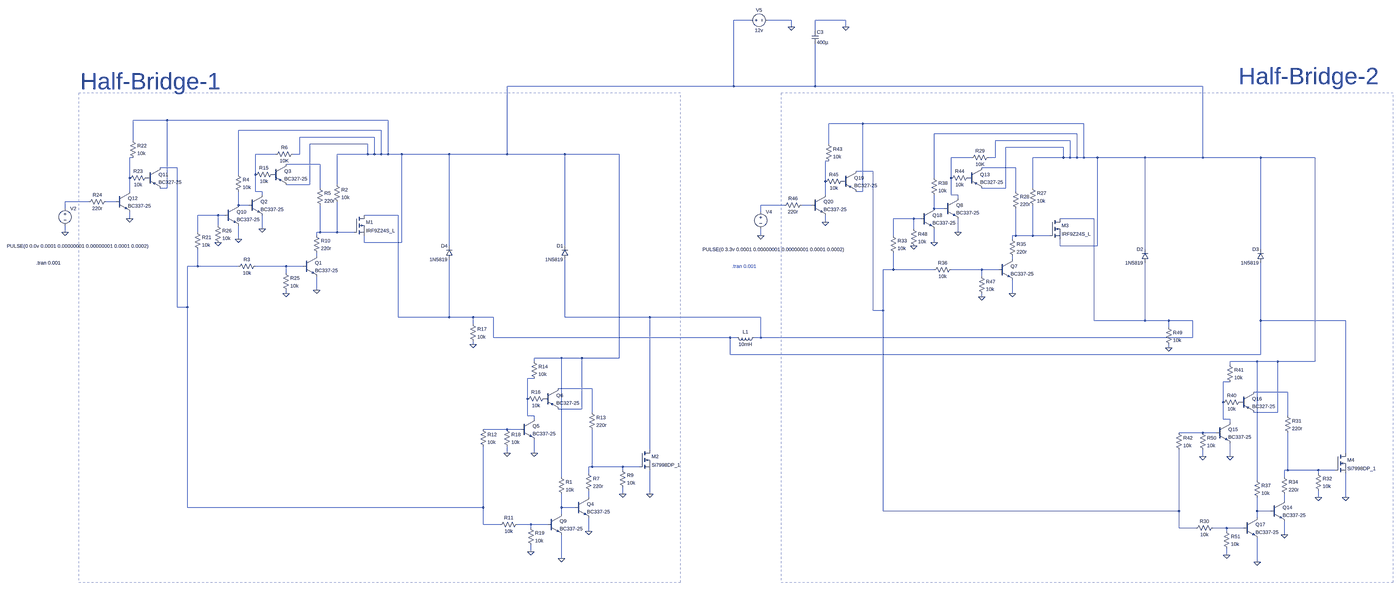
[diagram p0: schematic h-bridge-motor-driver-v1.asc, whole sheet]
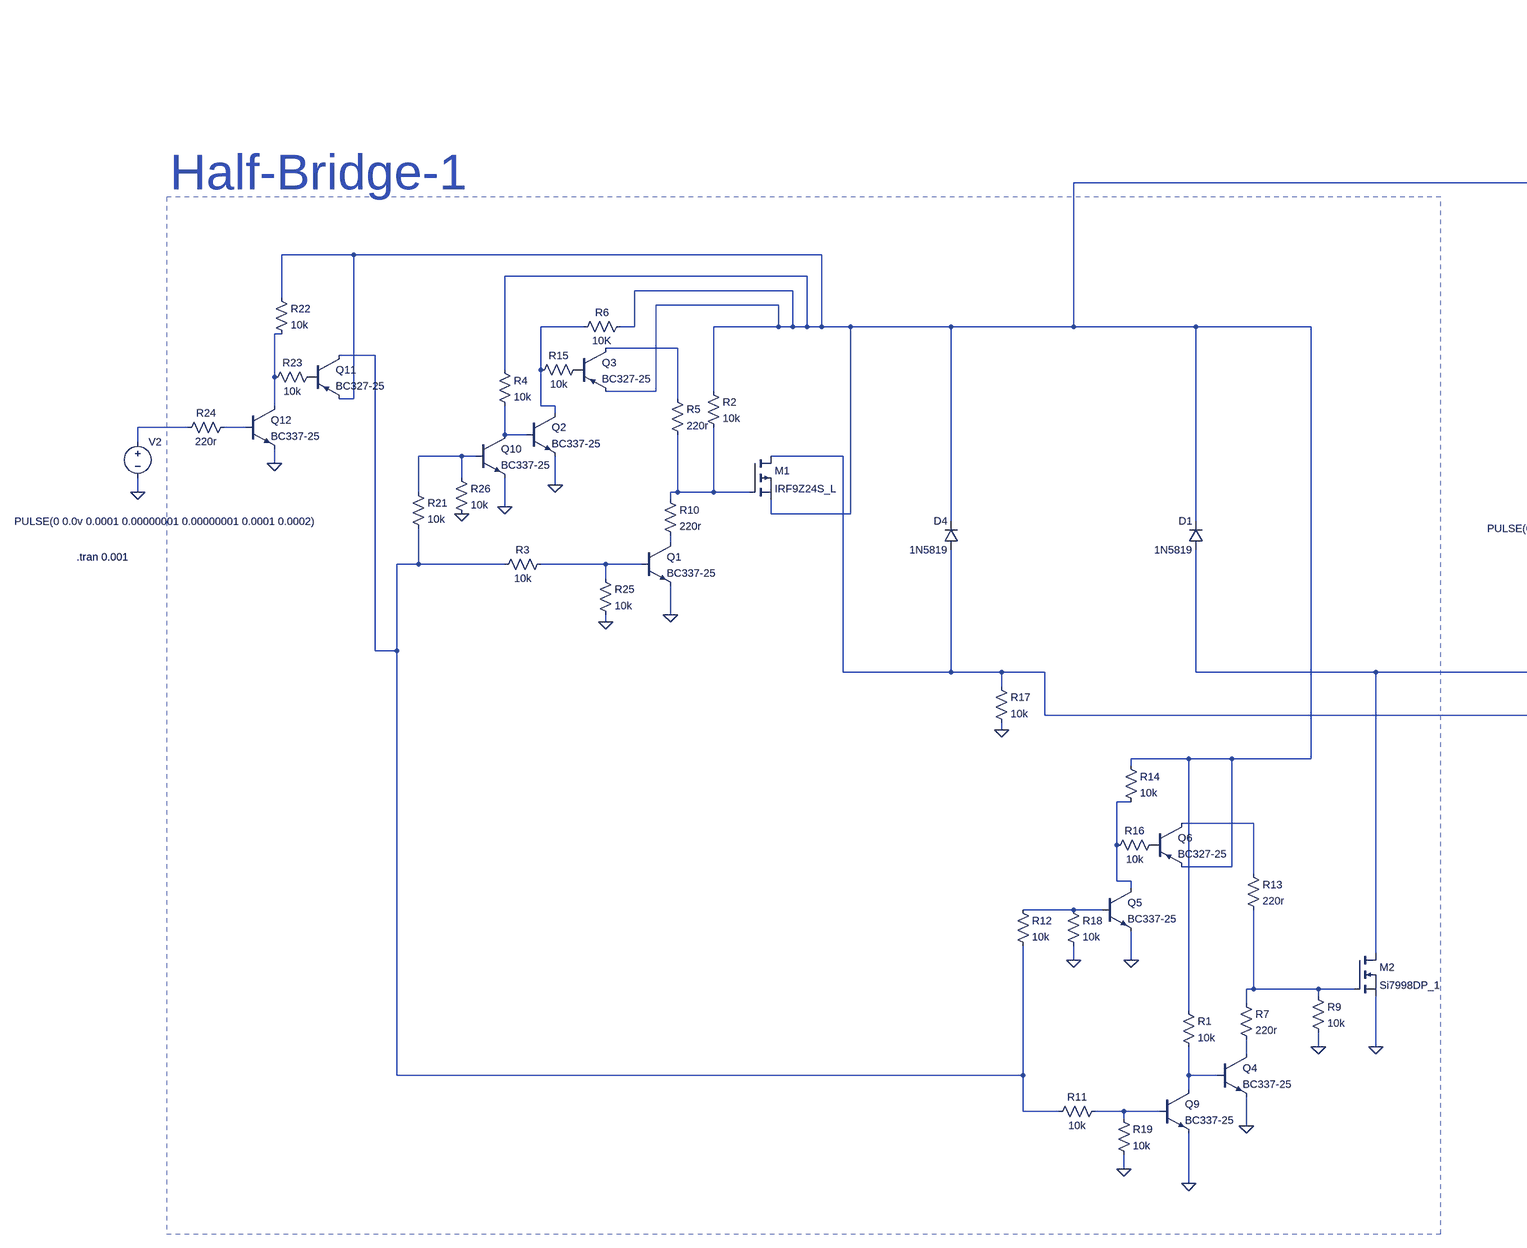
[diagram p1: schematic h-bridge-motor-driver-v1.asc, part, row 1 of 1, column 1 of 2]
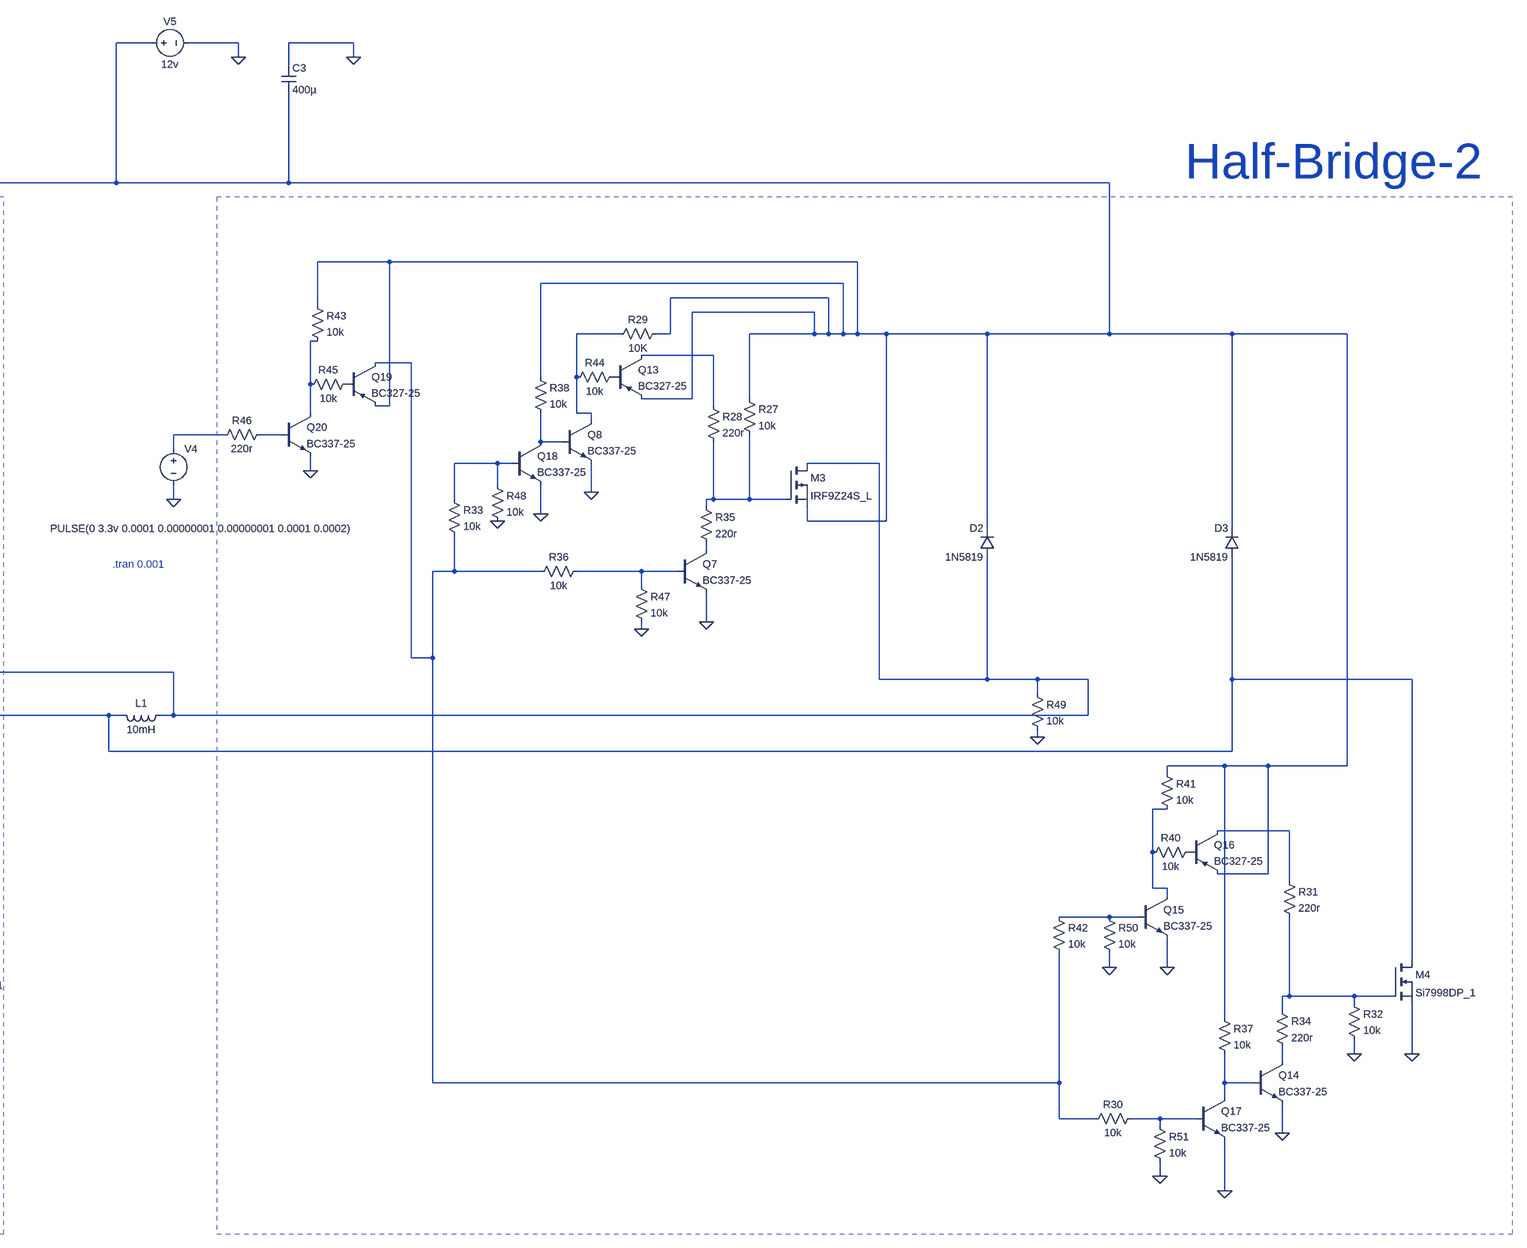
[diagram p2: schematic h-bridge-motor-driver-v1.asc, part, row 1 of 1, column 2 of 2]
h-bridge-motor-driver-v1.asc, the LTspice schematic file:
Version 4.1
SHEET 1 4912 2688
WIRE 1872 -1104 1792 -1104
WIRE 2064 -1104 1952 -1104
WIRE 2320 -1104 2176 -1104
WIRE 2064 -1072 2064 -1104
WIRE 2320 -1072 2320 -1104
WIRE 2176 -1056 2176 -1104
WIRE 1792 -720 1792 -1104
WIRE 1792 -720 688 -720
WIRE 2176 -720 2176 -992
WIRE 2176 -720 1792 -720
WIRE 4000 -720 2176 -720
WIRE -912 -560 -1072 -560
WIRE 128 -560 -912 -560
WIRE 2400 -544 2240 -544
WIRE 3440 -544 2400 -544
WIRE 96 -512 -576 -512
WIRE 3408 -496 2736 -496
WIRE 64 -480 -288 -480
WIRE -1072 -464 -1072 -560
WIRE 3376 -464 3024 -464
WIRE 32 -448 -240 -448
WIRE 2240 -448 2240 -544
WIRE 3344 -432 3072 -432
WIRE -400 -400 -496 -400
WIRE -288 -400 -288 -480
WIRE -288 -400 -320 -400
WIRE 32 -400 32 -448
WIRE 32 -400 -112 -400
WIRE 64 -400 64 -480
WIRE 64 -400 32 -400
WIRE 96 -400 96 -512
WIRE 96 -400 64 -400
WIRE 128 -400 128 -560
WIRE 128 -400 96 -400
WIRE 192 -400 128 -400
WIRE 416 -400 192 -400
WIRE 688 -400 688 -720
WIRE 688 -400 416 -400
WIRE 960 -400 688 -400
WIRE 1216 -400 960 -400
WIRE -1072 -384 -1088 -384
WIRE 2912 -384 2816 -384
WIRE 3024 -384 3024 -464
WIRE 3024 -384 2992 -384
WIRE 3344 -384 3344 -432
WIRE 3344 -384 3200 -384
WIRE 3376 -384 3376 -464
WIRE 3376 -384 3344 -384
WIRE 3408 -384 3408 -496
WIRE 3408 -384 3376 -384
WIRE 3440 -384 3440 -544
WIRE 3440 -384 3408 -384
WIRE 3504 -384 3440 -384
WIRE 3728 -384 3504 -384
WIRE 4000 -384 4000 -720
WIRE 4000 -384 3728 -384
WIRE 4272 -384 4000 -384
WIRE 4528 -384 4272 -384
WIRE 2240 -368 2224 -368
WIRE -192 -352 -352 -352
WIRE -864 -336 -944 -336
WIRE 3120 -336 2960 -336
WIRE 2448 -320 2368 -320
WIRE -576 -304 -576 -512
WIRE -496 -304 -496 -400
WIRE -1088 -288 -1088 -384
WIRE 2736 -288 2736 -496
WIRE 2816 -288 2816 -384
WIRE 2224 -272 2224 -368
WIRE -240 -256 -240 -448
WIRE -240 -256 -352 -256
WIRE -112 -256 -112 -400
WIRE -912 -240 -912 -560
WIRE -912 -240 -944 -240
WIRE -192 -240 -192 -352
WIRE 3072 -240 3072 -432
WIRE 3072 -240 2960 -240
WIRE 3200 -240 3200 -384
WIRE -1088 -224 -1088 -288
WIRE -496 -224 -496 -304
WIRE -464 -224 -496 -224
WIRE 2400 -224 2400 -544
WIRE 2400 -224 2368 -224
WIRE 3120 -224 3120 -336
WIRE -464 -208 -464 -224
WIRE 2224 -208 2224 -272
WIRE 2816 -208 2816 -288
WIRE 2848 -208 2816 -208
WIRE 2848 -192 2848 -208
WIRE -1280 -176 -1392 -176
WIRE -1152 -176 -1200 -176
WIRE -576 -160 -576 -224
WIRE -528 -160 -576 -160
WIRE 2032 -160 1920 -160
WIRE 2160 -160 2112 -160
WIRE -1392 -144 -1392 -176
WIRE 2736 -144 2736 -208
WIRE 2784 -144 2736 -144
WIRE 1920 -128 1920 -160
WIRE -672 -112 -768 -112
WIRE -640 -112 -672 -112
WIRE 176 -112 16 -112
WIRE -1088 -96 -1088 -128
WIRE 2640 -96 2544 -96
WIRE 2672 -96 2640 -96
WIRE 3488 -96 3328 -96
WIRE 2224 -80 2224 -112
WIRE -672 -64 -672 -112
WIRE -464 -48 -464 -112
WIRE 2640 -48 2640 -96
WIRE -1392 -32 -1392 -64
WIRE -768 -32 -768 -112
WIRE -192 -32 -192 -160
WIRE -192 -32 -208 -32
WIRE -112 -32 -112 -176
WIRE -112 -32 -192 -32
WIRE -32 -32 -112 -32
WIRE 2848 -32 2848 -96
WIRE -208 -16 -208 -32
WIRE 1920 -16 1920 -48
WIRE 2544 -16 2544 -96
WIRE 3120 -16 3120 -144
WIRE 3120 -16 3104 -16
WIRE 3200 -16 3200 -160
WIRE 3200 -16 3120 -16
WIRE 3280 -16 3200 -16
WIRE -576 0 -576 -64
WIRE 3104 0 3104 -16
WIRE 16 16 16 -16
WIRE 192 16 192 -400
WIRE 192 16 16 16
WIRE 2736 16 2736 -48
WIRE 416 32 416 -400
WIRE 960 32 960 -400
WIRE 3328 32 3328 0
WIRE 3504 32 3504 -384
WIRE 3504 32 3328 32
WIRE 3728 48 3728 -384
WIRE 4272 48 4272 -384
WIRE -208 80 -208 64
WIRE 3104 96 3104 80
WIRE -768 128 -768 48
WIRE -768 128 -816 128
WIRE -576 128 -768 128
WIRE -352 128 -496 128
WIRE -272 128 -352 128
WIRE 2544 144 2544 64
WIRE 2544 144 2496 144
WIRE 2736 144 2544 144
WIRE 2960 144 2816 144
WIRE 3040 144 2960 144
WIRE -352 160 -352 128
WIRE 2960 176 2960 144
WIRE -208 240 -208 176
WIRE -352 256 -352 240
WIRE 3104 256 3104 192
WIRE 2960 272 2960 256
WIRE -864 320 -864 -336
WIRE -816 320 -816 128
WIRE -816 320 -864 320
WIRE 2448 336 2448 -320
WIRE 2496 336 2496 144
WIRE 2496 336 2448 336
WIRE 176 368 176 -112
WIRE 416 368 416 96
WIRE 416 368 176 368
WIRE 528 368 416 368
WIRE 624 368 528 368
WIRE 960 368 960 96
WIRE 1360 368 960 368
WIRE 1920 368 1360 368
WIRE 3488 384 3488 -96
WIRE 3728 384 3728 112
WIRE 3728 384 3488 384
WIRE 3840 384 3728 384
WIRE 3952 384 3840 384
WIRE 4272 384 4272 112
WIRE 4672 384 4272 384
WIRE 528 400 528 368
WIRE 3840 416 3840 384
WIRE 624 464 624 368
WIRE 1776 464 624 464
WIRE 1808 464 1776 464
WIRE 1920 464 1920 368
WIRE 1920 464 1888 464
WIRE 3952 464 3952 384
WIRE 3952 464 1920 464
WIRE 528 496 528 480
WIRE 3840 512 3840 496
WIRE 1776 544 1776 464
WIRE 4272 544 4272 384
WIRE 4272 544 1776 544
WIRE 944 560 816 560
WIRE 1040 560 944 560
WIRE 1216 560 1216 -400
WIRE 1216 560 1040 560
WIRE 816 576 816 560
WIRE 4256 576 4128 576
WIRE 4352 576 4256 576
WIRE 4528 576 4528 -384
WIRE 4528 576 4352 576
WIRE 4128 592 4128 576
WIRE 816 656 784 656
WIRE 4128 672 4096 672
WIRE 1088 704 928 704
WIRE 4400 720 4240 720
WIRE 784 752 784 656
WIRE 4096 768 4096 672
WIRE 1040 800 1040 560
WIRE 1040 800 928 800
WIRE 1088 816 1088 704
WIRE 4352 816 4352 576
WIRE 4352 816 4240 816
WIRE 784 832 784 752
WIRE 816 832 784 832
WIRE 4400 832 4400 720
WIRE 816 848 816 832
WIRE 4096 848 4096 768
WIRE 4128 848 4096 848
WIRE 4128 864 4128 848
WIRE 688 896 576 896
WIRE 752 896 688 896
WIRE 4000 912 3888 912
WIRE 4064 912 4000 912
WIRE 1360 992 1360 368
WIRE 688 1008 688 976
WIRE 816 1008 816 944
WIRE 4672 1008 4672 384
WIRE 4000 1024 4000 992
WIRE 4128 1024 4128 960
WIRE 1088 1072 1088 896
WIRE 1088 1072 1072 1072
WIRE 1232 1072 1088 1072
WIRE 1312 1072 1232 1072
WIRE 1232 1088 1232 1072
WIRE 4400 1088 4400 912
WIRE 4400 1088 4384 1088
WIRE 4544 1088 4400 1088
WIRE 4624 1088 4544 1088
WIRE 1072 1104 1072 1072
WIRE 4544 1104 4544 1088
WIRE 944 1120 944 560
WIRE 4384 1120 4384 1088
WIRE 4256 1136 4256 576
WIRE 1232 1200 1232 1168
WIRE 1360 1200 1360 1088
WIRE 1072 1216 1072 1184
WIRE 4544 1216 4544 1184
WIRE 4672 1216 4672 1104
WIRE 4384 1232 4384 1200
WIRE -816 1264 -816 320
WIRE 576 1264 576 976
WIRE 576 1264 -816 1264
WIRE 944 1264 944 1200
WIRE 1008 1264 944 1264
WIRE 2496 1280 2496 336
WIRE 3888 1280 3888 992
WIRE 3888 1280 2496 1280
WIRE 4256 1280 4256 1216
WIRE 4320 1280 4256 1280
WIRE 944 1296 944 1264
WIRE 4256 1312 4256 1280
WIRE 576 1344 576 1264
WIRE 656 1344 576 1344
WIRE 800 1344 736 1344
WIRE 880 1344 800 1344
WIRE 800 1360 800 1344
WIRE 3888 1360 3888 1280
WIRE 3968 1360 3888 1360
WIRE 4112 1360 4048 1360
WIRE 4192 1360 4112 1360
WIRE 1072 1376 1072 1312
WIRE 4112 1376 4112 1360
WIRE 4384 1392 4384 1328
WIRE 800 1472 800 1440
WIRE 4112 1488 4112 1456
WIRE 944 1504 944 1392
WIRE 4256 1520 4256 1408
FLAG -208 240 0
FLAG -464 -48 0
FLAG 1360 1200 0
FLAG 1232 1200 0
FLAG 1072 1376 0
FLAG 816 1008 0
FLAG 944 1504 0
FLAG -576 0 0
FLAG -1088 -96 0
FLAG -1392 -32 0
FLAG -672 16 0
FLAG -352 256 0
FLAG 528 496 0
FLAG 688 1008 0
FLAG 800 1472 0
FLAG 3104 256 0
FLAG 2848 -32 0
FLAG 4672 1216 0
FLAG 4544 1216 0
FLAG 4384 1392 0
FLAG 4128 1024 0
FLAG 4256 1520 0
FLAG 2736 16 0
FLAG 2224 -80 0
FLAG 1920 -16 0
FLAG 2640 32 0
FLAG 2960 272 0
FLAG 3840 512 0
FLAG 4000 1024 0
FLAG 4112 1488 0
FLAG 2064 -1072 0
FLAG 2320 -1072 0
SYMBOL pmos -32 -112 R0
SYMATTR InstName M1
SYMATTR Value IRF9Z24S_L
SYMBOL npn -272 80 R0
SYMATTR InstName Q1
SYMATTR Value BC337-25
SYMBOL res -128 -272 R0
SYMATTR InstName R2
SYMATTR Value 10k
SYMBOL npn -528 -208 R0
SYMATTR InstName Q2
SYMATTR Value BC337-25
SYMBOL pnp -416 -352 R0
SYMATTR InstName Q3
SYMATTR Value BC327-25
SYMBOL res -208 -256 R0
SYMATTR InstName R5
SYMATTR Value 220r
SYMBOL res -304 -416 R90
WINDOW 0 0 56 VBottom 2
WINDOW 3 32 56 VTop 2
SYMATTR InstName R6
SYMATTR Value 10K
SYMBOL nmos 1312 992 R0
SYMATTR InstName M2
SYMATTR Value Si7998DP_1
SYMBOL npn 1008 1216 R0
SYMATTR InstName Q4
SYMATTR Value BC337-25
SYMBOL res 752 1328 R90
WINDOW 0 0 56 VBottom 2
WINDOW 3 32 56 VTop 2
SYMATTR InstName R11
SYMATTR Value 10k
SYMBOL npn 752 848 R0
SYMATTR InstName Q5
SYMATTR Value BC337-25
SYMBOL pnp 864 704 R0
SYMATTR InstName Q6
SYMATTR Value BC327-25
SYMBOL res 1072 800 R0
SYMATTR InstName R13
SYMATTR Value 220r
SYMBOL res 1216 1072 R0
SYMATTR InstName R9
SYMATTR Value 10k
SYMBOL res -784 -48 R0
SYMATTR InstName R21
SYMATTR Value 10k
SYMBOL res 1056 1088 R0
SYMATTR InstName R7
SYMATTR Value 220r
SYMBOL res -224 -32 R0
SYMATTR InstName R10
SYMATTR Value 220r
SYMBOL res -480 112 R90
WINDOW 0 0 56 VBottom 2
WINDOW 3 32 56 VTop 2
SYMATTR InstName R3
SYMATTR Value 10k
SYMBOL res 928 1104 R0
SYMATTR InstName R1
SYMATTR Value 10k
SYMBOL npn 880 1296 R0
SYMATTR InstName Q9
SYMATTR Value BC337-25
SYMBOL npn -640 -160 R0
SYMATTR InstName Q10
SYMATTR Value BC337-25
SYMBOL res -592 -320 R0
SYMATTR InstName R4
SYMATTR Value 10k
SYMBOL res 880 736 R90
WINDOW 0 0 56 VBottom 2
WINDOW 3 32 56 VTop 2
SYMATTR InstName R16
SYMATTR Value 10k
SYMBOL res 800 560 R0
SYMATTR InstName R14
SYMATTR Value 10k
SYMBOL res 560 880 R0
SYMATTR InstName R12
SYMATTR Value 10k
SYMBOL pnp -1008 -336 R0
SYMATTR InstName Q11
SYMATTR Value BC327-25
SYMBOL res -1088 -480 R0
SYMATTR InstName R22
SYMATTR Value 10k
SYMBOL res -400 -320 R90
WINDOW 0 0 56 VBottom 2
WINDOW 3 32 56 VTop 2
SYMATTR InstName R15
SYMATTR Value 10k
SYMBOL res -992 -304 R90
WINDOW 0 0 56 VBottom 2
WINDOW 3 32 56 VTop 2
SYMATTR InstName R23
SYMATTR Value 10k
SYMBOL npn -1152 -224 R0
SYMATTR InstName Q12
SYMATTR Value BC337-25
SYMBOL voltage -1392 -160 R0
WINDOW 123 0 0 Left 0
WINDOW 39 0 0 Left 0
WINDOW 3 -274 193 Left 2
SYMATTR Value PULSE(0 0.0v 0.0001 0.00000001 0.00000001 0.0001 0.0002)
SYMATTR InstName V2
SYMBOL res -1184 -192 R90
WINDOW 0 0 56 VBottom 2
WINDOW 3 32 56 VTop 2
SYMATTR InstName R24
SYMATTR Value 220r
SYMBOL diode 432 96 R180
WINDOW 0 24 64 Left 2
WINDOW 3 24 0 Left 2
SYMATTR InstName D4
SYMATTR Value 1N5819
SYMBOL res -368 144 R0
SYMATTR InstName R25
SYMATTR Value 10k
SYMBOL res -688 -80 R0
SYMATTR InstName R26
SYMATTR Value 10k
SYMBOL diode 976 96 R180
WINDOW 0 24 64 Left 2
WINDOW 3 24 0 Left 2
SYMATTR InstName D1
SYMATTR Value 1N5819
SYMBOL res 512 384 R0
SYMATTR InstName R17
SYMATTR Value 10k
SYMBOL res 672 880 R0
SYMATTR InstName R18
SYMATTR Value 10k
SYMBOL res 784 1344 R0
SYMATTR InstName R19
SYMATTR Value 10k
SYMBOL pmos 3280 -96 R0
SYMATTR InstName M3
SYMATTR Value IRF9Z24S_L
SYMBOL npn 3040 96 R0
SYMATTR InstName Q7
SYMATTR Value BC337-25
SYMBOL res 3184 -256 R0
SYMATTR InstName R27
SYMATTR Value 10k
SYMBOL npn 2784 -192 R0
SYMATTR InstName Q8
SYMATTR Value BC337-25
SYMBOL pnp 2896 -336 R0
SYMATTR InstName Q13
SYMATTR Value BC327-25
SYMBOL res 3104 -240 R0
SYMATTR InstName R28
SYMATTR Value 220r
SYMBOL res 3008 -400 R90
WINDOW 0 0 56 VBottom 2
WINDOW 3 32 56 VTop 2
SYMATTR InstName R29
SYMATTR Value 10K
SYMBOL nmos 4624 1008 R0
SYMATTR InstName M4
SYMATTR Value Si7998DP_1
SYMBOL npn 4320 1232 R0
SYMATTR InstName Q14
SYMATTR Value BC337-25
SYMBOL res 4064 1344 R90
WINDOW 0 0 56 VBottom 2
WINDOW 3 32 56 VTop 2
SYMATTR InstName R30
SYMATTR Value 10k
SYMBOL npn 4064 864 R0
SYMATTR InstName Q15
SYMATTR Value BC337-25
SYMBOL pnp 4176 720 R0
SYMATTR InstName Q16
SYMATTR Value BC327-25
SYMBOL res 4384 816 R0
SYMATTR InstName R31
SYMATTR Value 220r
SYMBOL res 4528 1088 R0
SYMATTR InstName R32
SYMATTR Value 10k
SYMBOL res 2528 -32 R0
SYMATTR InstName R33
SYMATTR Value 10k
SYMBOL res 4368 1104 R0
SYMATTR InstName R34
SYMATTR Value 220r
SYMBOL res 3088 -16 R0
SYMATTR InstName R35
SYMATTR Value 220r
SYMBOL res 2832 128 R90
WINDOW 0 0 56 VBottom 2
WINDOW 3 32 56 VTop 2
SYMATTR InstName R36
SYMATTR Value 10k
SYMBOL res 4240 1120 R0
SYMATTR InstName R37
SYMATTR Value 10k
SYMBOL npn 4192 1312 R0
SYMATTR InstName Q17
SYMATTR Value BC337-25
SYMBOL npn 2672 -144 R0
SYMATTR InstName Q18
SYMATTR Value BC337-25
SYMBOL res 2720 -304 R0
SYMATTR InstName R38
SYMATTR Value 10k
SYMBOL res 4192 752 R90
WINDOW 0 0 56 VBottom 2
WINDOW 3 32 56 VTop 2
SYMATTR InstName R40
SYMATTR Value 10k
SYMBOL res 4112 576 R0
SYMATTR InstName R41
SYMATTR Value 10k
SYMBOL res 3872 896 R0
SYMATTR InstName R42
SYMATTR Value 10k
SYMBOL pnp 2304 -320 R0
SYMATTR InstName Q19
SYMATTR Value BC327-25
SYMBOL res 2224 -464 R0
SYMATTR InstName R43
SYMATTR Value 10k
SYMBOL res 2912 -304 R90
WINDOW 0 0 56 VBottom 2
WINDOW 3 32 56 VTop 2
SYMATTR InstName R44
SYMATTR Value 10k
SYMBOL res 2320 -288 R90
WINDOW 0 0 56 VBottom 2
WINDOW 3 32 56 VTop 2
SYMATTR InstName R45
SYMATTR Value 10k
SYMBOL npn 2160 -208 R0
SYMATTR InstName Q20
SYMATTR Value BC337-25
SYMBOL voltage 1920 -144 R0
WINDOW 123 0 0 Left 0
WINDOW 39 0 0 Left 0
WINDOW 3 -274 193 Left 2
SYMATTR Value PULSE(0 3.3v 0.0001 0.00000001 0.00000001 0.0001 0.0002)
SYMATTR InstName V4
SYMBOL res 2128 -176 R90
WINDOW 0 0 56 VBottom 2
WINDOW 3 32 56 VTop 2
SYMATTR InstName R46
SYMATTR Value 220r
SYMBOL diode 3744 112 R180
WINDOW 0 24 64 Left 2
WINDOW 3 24 0 Left 2
SYMATTR InstName D2
SYMATTR Value 1N5819
SYMBOL res 2944 160 R0
SYMATTR InstName R47
SYMATTR Value 10k
SYMBOL res 2624 -64 R0
SYMATTR InstName R48
SYMATTR Value 10k
SYMBOL diode 4288 112 R180
WINDOW 0 24 64 Left 2
WINDOW 3 24 0 Left 2
SYMATTR InstName D3
SYMATTR Value 1N5819
SYMBOL res 3824 400 R0
SYMATTR InstName R49
SYMATTR Value 10k
SYMBOL res 3984 896 R0
SYMATTR InstName R50
SYMATTR Value 10k
SYMBOL res 4096 1360 R0
SYMATTR InstName R51
SYMATTR Value 10k
SYMBOL voltage 1856 -1104 R270
WINDOW 0 32 56 VTop 2
WINDOW 3 -32 56 VBottom 2
SYMATTR InstName V5
SYMATTR Value 12v
SYMBOL cap 2160 -1056 R0
SYMATTR InstName C3
SYMATTR Value 400µ
SYMBOL ind 1904 448 R90
WINDOW 0 5 56 VBottom 2
WINDOW 3 32 56 VTop 2
SYMATTR InstName L1
SYMATTR Value 10mH
SYMATTR SpiceLine Rser=10
TEXT -1528 112 Left 2 !.tran 0.001
TEXT 1784 128 Left 2 ;.tran 0.001
TEXT -1320 -744 Left 7 ;Half-Bridge-1
TEXT 4168 -768 Left 7 ;Half-Bridge-2
RECTANGLE Normal 2016 1616 4896 -688 2
RECTANGLE Normal -1328 1616 1504 -688 2

The netlist it stands for:
* h-bridge-motor-driver-v1.asc
M1 N017 N020 N001 N001 IRF9Z24S_L
Q1 N022 N024 0 0 BC337-25
R2 N001 N020 10k
Q2 N002 N012 0 0 BC337-25
Q3 N006 P001 N001 0 BC327-25
R5 N006 N020 220r
R6 N001 N002 10K
M2 N019 N032 0 0 Si7998DP_1
Q4 N034 N036 0 0 BC337-25
R11 N038 N007 10k
Q5 N026 N030 0 0 BC337-25
Q6 N028 P002 N001 0 BC327-25
R13 N028 N032 220r
R9 N032 0 10k
R21 N016 N007 10k
R7 N032 N034 220r
R10 N020 N022 220r
R3 N024 N007 10k
R1 N001 N036 10k
Q9 N036 N038 0 0 BC337-25
Q10 N012 N016 0 0 BC337-25
R4 N001 N012 10k
R16 P002 N026 10k
R14 N001 N026 10k
R12 N030 N007 10k
Q11 N007 P003 N001 0 BC327-25
R22 N001 N003 10k
R15 P001 N002 10k
R23 P003 N003 10k
Q12 N003 N011 0 0 BC337-25
V2 N010 0 PULSE(0 0.0v 0.0001 0.00000001 0.00000001 0.0001 0.0002)
R24 N011 N010 220r
D4 N017 N001 1N5819
R25 N024 0 10k
R26 N016 0 10k
D1 N019 N001 1N5819
R17 N017 0 10k
R18 N030 0 10k
R19 N038 0 10k
M3 N019 N021 N001 N001 IRF9Z24S_L
Q7 N023 N025 0 0 BC337-25
R27 N001 N021 10k
Q8 N004 N015 0 0 BC337-25
Q13 N008 P004 N001 0 BC327-25
R28 N008 N021 220r
R29 N001 N004 10K
M4 N017 N033 0 0 Si7998DP_1
Q14 N035 N037 0 0 BC337-25
R30 N039 N009 10k
Q15 N027 N031 0 0 BC337-25
Q16 N029 P005 N001 0 BC327-25
R31 N029 N033 220r
R32 N033 0 10k
R33 N018 N009 10k
R34 N033 N035 220r
R35 N021 N023 220r
R36 N025 N009 10k
R37 N001 N037 10k
Q17 N037 N039 0 0 BC337-25
Q18 N015 N018 0 0 BC337-25
R38 N001 N015 10k
R40 P005 N027 10k
R41 N001 N027 10k
R42 N031 N009 10k
Q19 N009 P006 N001 0 BC327-25
R43 N001 N005 10k
R44 P004 N004 10k
R45 P006 N005 10k
Q20 N005 N014 0 0 BC337-25
V4 N013 0 PULSE(0 3.3v 0.0001 0.00000001 0.00000001 0.0001 0.0002)
R46 N014 N013 220r
D2 N019 N001 1N5819
R47 N025 0 10k
R48 N018 0 10k
D3 N017 N001 1N5819
R49 N019 0 10k
R50 N031 0 10k
R51 N039 0 10k
V5 N001 0 12v
C3 0 N001 400µ
L1 N019 N017 10mH Rser=10
.model D D
.lib standard.dio
.model NPN NPN
.model PNP PNP
.lib standard.bjt
.model NMOS NMOS
.model PMOS PMOS
.lib standard.mos
.tran 0.001
* .tran 0.001
* Half-Bridge-1
* Half-Bridge-2
.backanno
.end